# EAGLE schematic piezo (EAGLE 7.4.0)
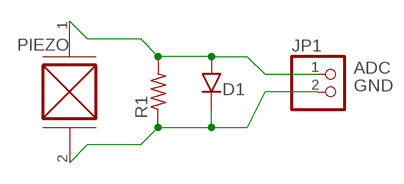
[diagram p0: schematic, sheet 1]

## Parts
D1  1N4148-3  [DO35-3]
JP1  HEADER-1X2  [1X02_OVAL]
R1  R-US_0204/7  [0204/7]
U$1  PIEZO  [1X02_PEIZO]

## Nets
ADC: D1.A JP1.1 R1.2 U$1.1(GND)
GND: D1.C JP1.2 R1.1 U$1.2(OUT+)

## Library data of the parts
D1 = ledB_sch:1N4148: Fast Switching Diode DO-35 glass case a.k.a. 1N914
JP1 = ledB_sch:HEADER-1X2: PIN HEADER
R1 = ledB_sch:R-US_: RESISTOR, American symbol
U$1 = ledB_sch:PIEZO